# Altium project Venus.PrjPcb
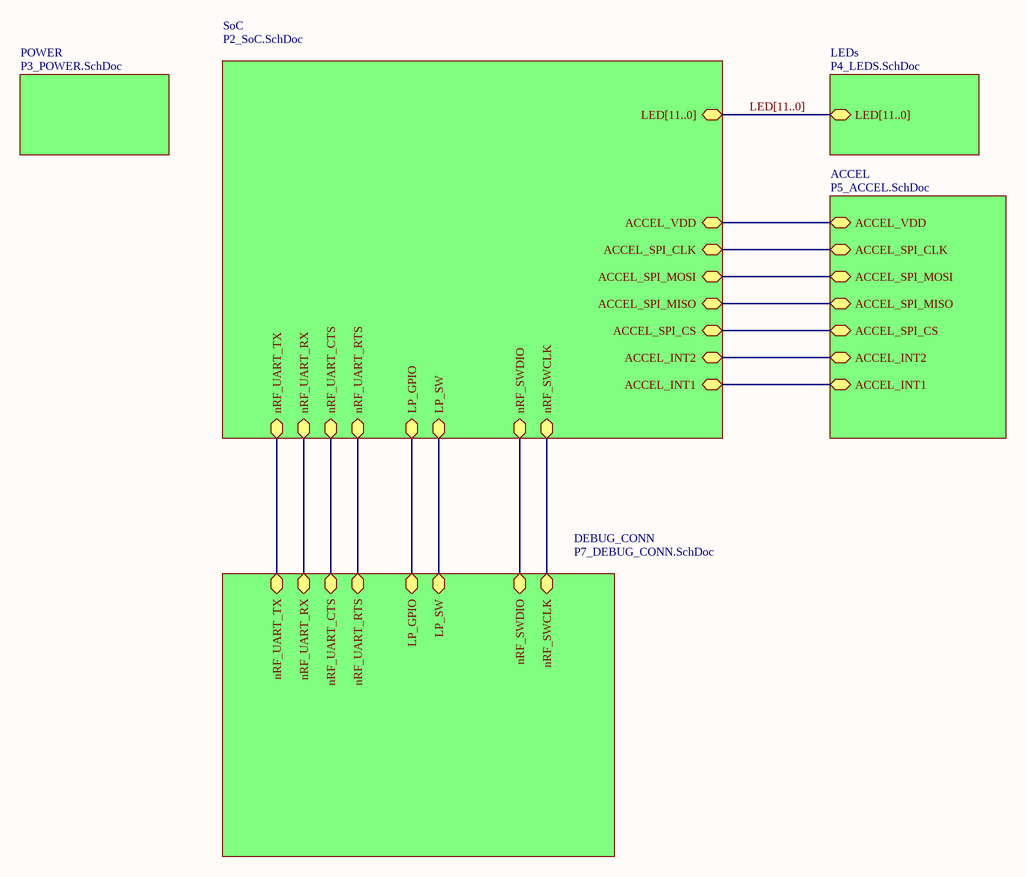
[diagram p0: P1_TOP_LEVEL.SchDoc]
Currency: USD; PCB_Description: PCB, Venus, FR4, 0.8T; PCBA_Description: PCBA, Venus; PCBAPartNumber: 06-00019-000; PCBArevision: 10; PCBPartNumber: 02-00037-000; PCBrevision: 5; ProductionQuantity: 50; Project_Title: Venus; Title: 06-00019-000 Venus
6 sheets, 73 parts. Net scope: hierarchical (ports join the sheet entries above them; power ports are global).
Board file: 02-00037-000.PcbDoc
Sheets:
  P1_TOP_LEVEL.SchDoc
    SoC = P2_SoC.SchDoc
    ACCEL = P5_ACCEL.SchDoc
    DEBUG_CONN = P7_DEBUG_CONN.SchDoc
    LEDs = P4_LEDS.SchDoc
    POWER = P3_POWER.SchDoc

## Sheet P1_TOP_LEVEL.SchDoc: 06-00019-000 Venus
size B; Organization: Misfit Wearables; Address1: 374 Woodrow St; Address2: Daly City; Address3: CA; Address4: USA

### Sub-sheets
ACCEL = P5_ACCEL.SchDoc: ACCEL_SPI_CLK, ACCEL_SPI_MOSI, ACCEL_SPI_MISO, ACCEL_SPI_CS, ACCEL_INT2, ACCEL_INT1, ACCEL_VDD
DEBUG_CONN = P7_DEBUG_CONN.SchDoc: nRF_SWDIO, nRF_SWCLK, nRF_UART_TX, nRF_UART_RX, nRF_UART_CTS, nRF_UART_RTS, LP_GPIO, LP_SW
LEDs = P4_LEDS.SchDoc: LED[11..0]
POWER = P3_POWER.SchDoc: no entries
SoC = P2_SoC.SchDoc: nRF_SWCLK, ACCEL_SPI_MOSI, ACCEL_INT1, ACCEL_INT2, nRF_SWDIO, ACCEL_SPI_MISO, ACCEL_SPI_CS, ACCEL_VDD, ACCEL_SPI_CLK, LED[11..0], nRF_UART_TX, nRF_UART_RX, nRF_UART_CTS, nRF_UART_RTS, LP_GPIO, LP_SW

### Nets
ACCEL_INT1: sheet SoC/ACCEL_INT1, sheet ACCEL/ACCEL_INT1
ACCEL_INT2: sheet SoC/ACCEL_INT2, sheet ACCEL/ACCEL_INT2
ACCEL_SPI_CLK: sheet SoC/ACCEL_SPI_CLK, sheet ACCEL/ACCEL_SPI_CLK
ACCEL_SPI_CS: sheet SoC/ACCEL_SPI_CS, sheet ACCEL/ACCEL_SPI_CS
ACCEL_SPI_MISO: sheet SoC/ACCEL_SPI_MISO, sheet ACCEL/ACCEL_SPI_MISO
ACCEL_SPI_MOSI: sheet SoC/ACCEL_SPI_MOSI, sheet ACCEL/ACCEL_SPI_MOSI
ACCEL_VDD: sheet SoC/ACCEL_VDD, sheet ACCEL/ACCEL_VDD
LP_GPIO: sheet SoC/LP_GPIO, sheet DEBUG_CONN/LP_GPIO
LP_SW: sheet SoC/LP_SW, sheet DEBUG_CONN/LP_SW
nRF_SWCLK: sheet SoC/nRF_SWCLK, sheet DEBUG_CONN/nRF_SWCLK
nRF_SWDIO: sheet SoC/nRF_SWDIO, sheet DEBUG_CONN/nRF_SWDIO
nRF_UART_CTS: sheet SoC/nRF_UART_CTS, sheet DEBUG_CONN/nRF_UART_CTS
nRF_UART_RTS: sheet SoC/nRF_UART_RTS, sheet DEBUG_CONN/nRF_UART_RTS
nRF_UART_RX: sheet SoC/nRF_UART_RX, sheet DEBUG_CONN/nRF_UART_RX
nRF_UART_TX: sheet SoC/nRF_UART_TX, sheet DEBUG_CONN/nRF_UART_TX

### Buses and harness runs
bus LED[11..0] = sheet LEDs/LED[11..0] = sheet SoC/LED[11..0]

### Notes on the sheet
- Title
- Size:
- Date:
- B
- Number:
- Time:
- Revision:
- Sheet
- of
- File:

## Sheet P2_SoC.SchDoc: 06-00019-000 Venus
size C
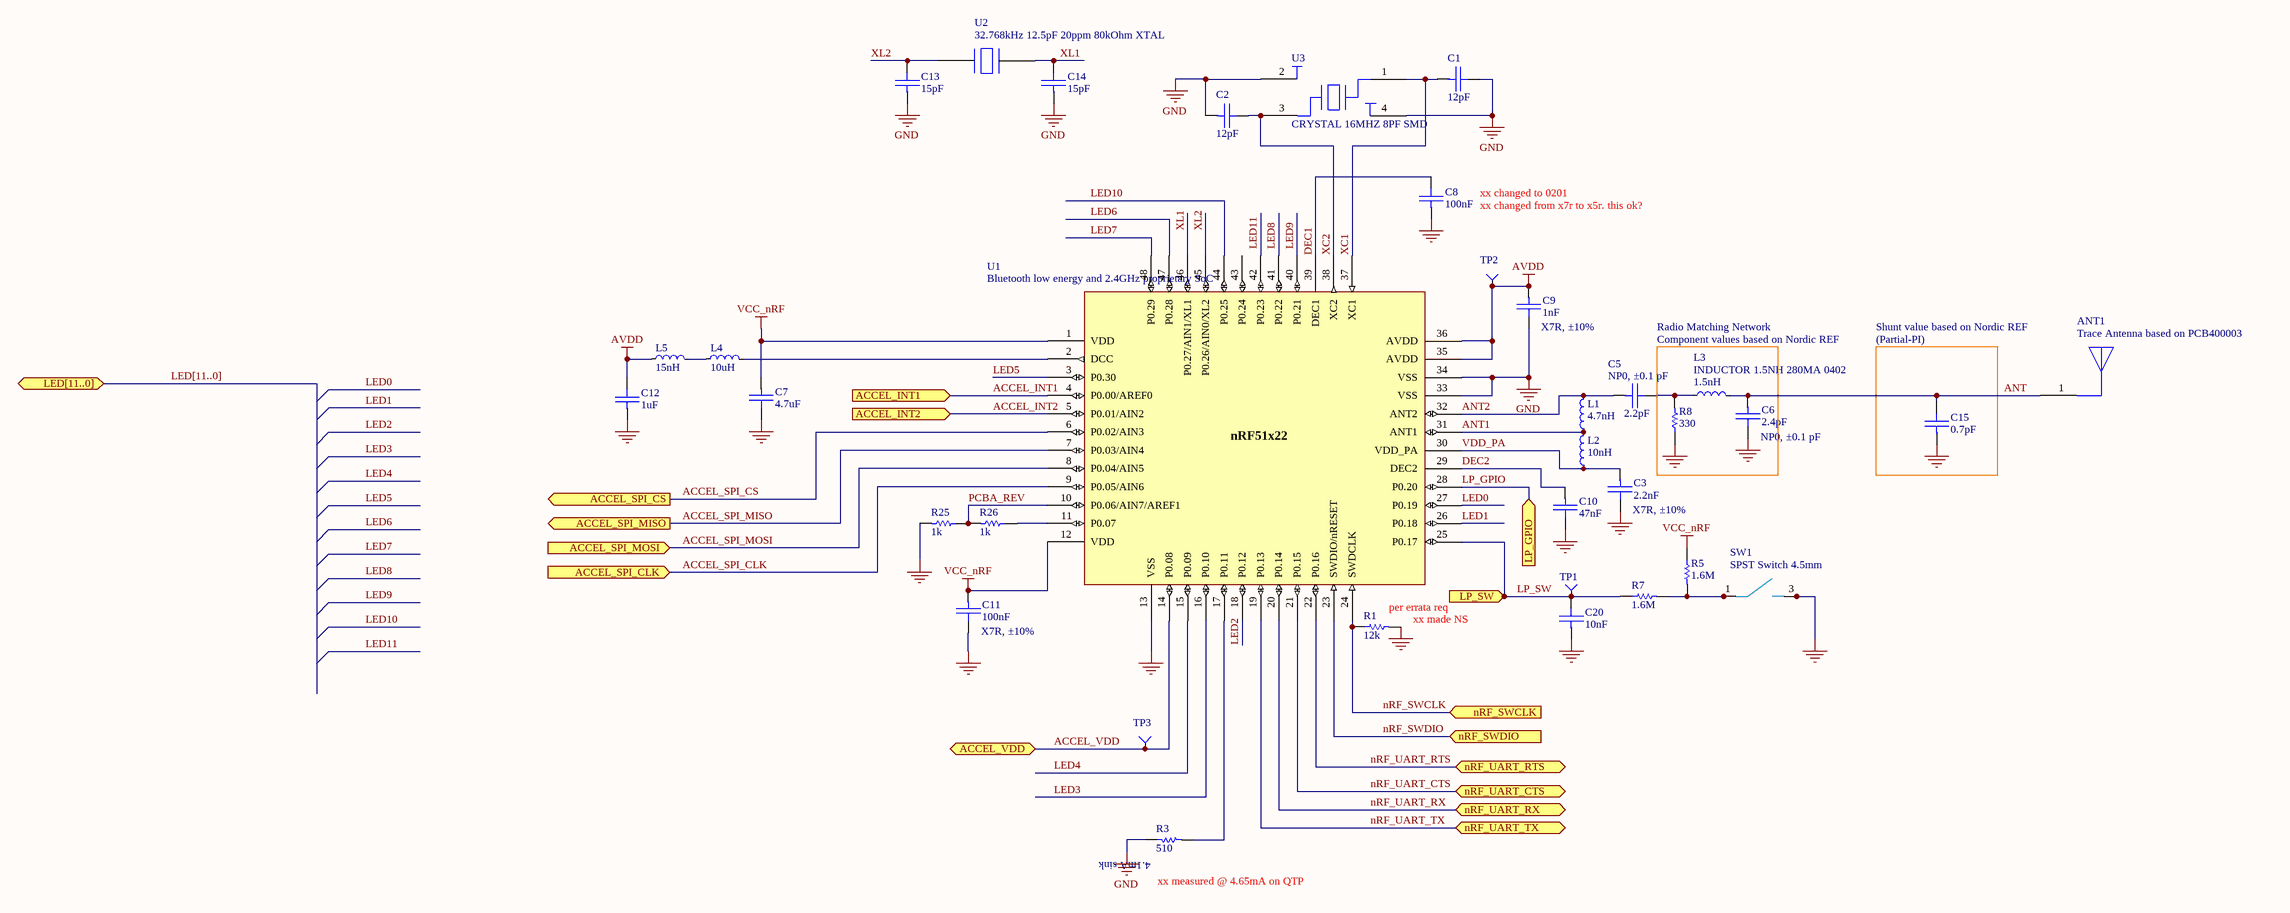
[diagram p1: P2_SoC.SchDoc]

### Parts
ANT1  Trace Antenna based on PCB400003  [NORDIC_MEAND]
C1  value 12pF  [CAPC0201(0603)_N]  (hidden comment: CAP CER 12PF 25V 5% NP0 0201)
C2  value 12pF  [CAPC0201(0603)_N]  (hidden comment: CAP CER 12PF 25V 5% NP0 0201)
C3  value 2.2nF  [CAPC0402(1005)_N]  (hidden comment: CAP CER 2200PF 50V 10% X7R 0402)
C5  value 2.2pF  [CAPC0402(1005)_N]  (hidden comment: CAP CER 2.2PF 50V NP0 0402)
C6  value 2.4pF  [CAPC0402(1005)_N]  (hidden comment: CAP CER 2.4PF 50V NP0 0402)
C7  value 4.7uF  [CAPC0603(1608)_N]  (hidden comment: CAP CER 4.7UF 6.3V 10% X5R 0603)
C8  value 100nF  [CAPC0201(0603)_N]  (hidden comment: CAP CER 0.1UF 10V 10% X5R 0201)
C9  value 1nF  [CAPC0402(1005)_N]  (hidden comment: CAP CER 1000PF 50V 10% X7R 0402)
C10  value 47nF  [CAPC0402(1005)_N]  (hidden comment: CAP CER 0.047UF 16V 10% X7R 0402)
C11  value 100nF  [CAPC0402(1005)_N]  (hidden comment: CAP CER 0.1UF 16V 10% X7R 0402)
C12  value 1uF  [CAPC0603(1608)_N]  (hidden comment: CAP CER 1UF 16V 20% X7R 0603)
C13  value 15pF  [CAPC0201(0603)_N]  (hidden comment: CAP CER 15PF 25V 5% NP0 0201)
C14  value 15pF  [CAPC0201(0603)_N]  (hidden comment: CAP CER 15PF 25V 5% NP0 0201)
C15  value 0.7pF  [CAPC0402(1005)_N]  (hidden comment: CAP CER 0.7PF 50V NP0 0402)
C20  value 10nF  [CAPC0201(0603)_N]  (hidden comment: CAP CER 10000PF 10V 10% X7R 0201)
L1  value 4.7nH  [INDC0402(1005)_N]  (hidden comment: INDUCTOR 4.7NH 160MA 0402)
L2  value 10nH  [INDC0402(1005)_N]  (hidden comment: INDUCTOR 10NH 100MA 0402)
L3  INDUCTOR 1.5NH 280MA 0402  value 1.5nH  [INDC0402(1005)_N]
L4  value 10uH  [INDC0603(1608)_N]  (hidden comment: INDUCTOR 10UH 80MA 10% 0603)
L5  value 15nH  [INDC0402(1005)_N]  (hidden comment: INDUCTOR HI FREQ 15NH 5% 0402)
R1  value 12k  [RESC0201(0603)_N]  (hidden comment: RES 12K OHM 1/20W 1% 0201 SMD)
R3  value 510  [RESC0201(0603)_N]  (hidden comment: RES 510 OHM 1/20W 5% 0201 SMD)
R5  value 1.6M  [RESC0402(1005)_N]  (hidden comment: RES 1.60M OHM 1/16W 1% 0402 SMD)
R7  value 1.6M  [RESC0402(1005)_N]  (hidden comment: RES 1.60M OHM 1/16W 1% 0402 SMD)
R8  value 330  [RESC0402(1005)_N]  (hidden comment: RES 330 OHM 1/16W 5% 0402 SMD)
R25  value 1k  [RESC0201(0603)_N]  (hidden comment: RES 1K OHM 1/20W 5% 0201 SMD)
R26  value 1k  [RESC0201(0603)_N]  (hidden comment: RES 1K OHM 1/20W 5% 0201 SMD)
SW1  SPST Switch 4.5mm  [PTS530]
TP1  12MIL SMT Test Point  [SMT_TP_12MIL]  (value not drawn)
TP2  .767mm SMT Test Point  [SMT_TP_p767mm]  (value not drawn)
TP3  .767mm SMT Test Point  [SMT_TP_p767mm]  (value not drawn)
U1  Bluetooth low energy and 2.4GHz proprietary SoC  [QFN40P600X600X90-48N]
U2  32.768kHz 12.5pF 20ppm 80kOhm XTAL  [ECX-12]
U3  CRYSTAL 16MHZ 8PF SMD  [NX2520SA]

### Ports
ACCEL_INT1, ACCEL_INT2, ACCEL_SPI_CLK, ACCEL_SPI_CS, ACCEL_SPI_MISO, ACCEL_SPI_MOSI, ACCEL_VDD, LED[11..0], LP_GPIO, LP_SW, nRF_SWCLK, nRF_SWDIO, nRF_UART_CTS, nRF_UART_RTS, nRF_UART_RX, nRF_UART_TX

### Nets
AVDD: C9.1 C12.2 L5.1 TP2.1(TP) U1.35(AVDD) U1.36(AVDD)
GND: C1.2 C2.1 C3.2 C6.2 C7.2 C8.1 C9.2 C10.2 C11.2 C12.1 C13.1 C14.1 C15.1 C20.1 R1.2 R3.1 R8.1 R25.2 SW1.3 SW1.4 U1.13(VSS) U1.33(VSS) U1.34(VSS) U1.49 U3.2(gnd) U3.4(GND)
VCC_nRF: C7.1 C11.1 R5.1 U1.1(VDD) U1.12(VDD)  [project net Vbat]
ACCEL_INT1: U1.4(P0.00/AREF0) ; port ACCEL_INT1
ACCEL_INT2: U1.5(P0.01/AIN2) ; port ACCEL_INT2
ACCEL_SPI_CLK: U1.9(P0.05/AIN6) ; port ACCEL_SPI_CLK
ACCEL_SPI_CS: U1.6(P0.02/AIN3) ; port ACCEL_SPI_CS
ACCEL_SPI_MISO: U1.7(P0.03/AIN4) ; port ACCEL_SPI_MISO
ACCEL_SPI_MOSI: U1.8(P0.04/AIN5) ; port ACCEL_SPI_MOSI
ACCEL_VDD: TP3.1(TP) U1.14(P0.08) ; port ACCEL_VDD
ANT: ANT1.1(Feed_Point) C6.1 C15.2 L3.2
ANT1: L1.1 L2.2 U1.31(ANT1)
ANT2: C5.1 L1.2 U1.32(ANT2)
DEC1: C8.2 U1.39(DEC1)
DEC2: C10.1 U1.29(DEC2)
LED0: U1.27(P0.19)
LED1: U1.26(P0.18)
LED2: U1.18(P0.12)
LED3: U1.16(P0.10)
LED4: U1.15(P0.09)
LED5: U1.3(P0.30)
LED6: U1.47(P0.28)
LED7: U1.48(P0.29)
LED8: U1.41(P0.22)
LED9: U1.40(P0.21)
LED10: U1.44(P0.25)
LED11: U1.42(P0.23)
LP_GPIO: U1.28(P0.20) ; port LP_GPIO
LP_SW: C20.2 R7.1 TP1.1(TP) U1.25(P0.17) ; port LP_SW
nRF_SWCLK: R1.1 U1.24(SWDCLK) ; port nRF_SWCLK
nRF_SWDIO: U1.23(SWDIO/nRESET) ; port nRF_SWDIO
nRF_UART_CTS: U1.21(P0.15) ; port nRF_UART_CTS
nRF_UART_RTS: U1.22(P0.16) ; port nRF_UART_RTS
nRF_UART_RX: U1.20(P0.14) ; port nRF_UART_RX
nRF_UART_TX: U1.19(P0.13) ; port nRF_UART_TX
PCBA_REV: R25.1 R26.2 U1.10(P0.06/AIN7/AREF1)
VDD_PA: C3.1 L2.1 U1.30(VDD_PA)
XC1: C1.1 U1.37(XC1) U3.1(I/O)
XC2: C2.2 U1.38(XC2) U3.3(I/O)
XL1: C14.2 U1.46(P0.27/AIN1/XL1) U2.2
XL2: C13.2 U1.45(P0.26/AIN0/XL2) U2.1
NetC5_2: C5.2 L3.1 R8.2
NetL4_1: L4.1 L5.2
NetL4_2: L4.2 U1.2(DCC)
NetR3_2: R3.2 U1.17(P0.11)
NetR5_2: R5.2 R7.2 SW1.1 SW1.2
NetR26_1: R26.1 U1.11(P0.07)

Not connected (* = marked no-connect by the designer): U1 43(P0.24)

### Buses and harness runs
bus LED[11..0] = port LED[11..0]

### Notes on the sheet
- xx changed to 0201
- xx changed from x7r to x5r. this ok?
- (near C9) X7R, ±10%
- Radio Matching Network
- Shunt value based on Nordic REF
- (near C5) NP0, ±0.1 pF
- Component values based on Nordic REF
- (Partial-PI)
- (near C6) NP0, ±0.1 pF
- (near C3) X7R, ±10%
- per errata req
- xx made NS
- (near C11) Analog Stuff Option Tracking
  R26         |     R25
  0MOhm     |     1MOhm    ==> 06-00019-000 REV9
  1k             |      1k            ==> REV10
- (near C11) X7R, ±10%
- (near R3) 4.1mA sink
- (near R3) xx measured @ 4.65mA on QTP
- Title
- Size:
- Date:
- File:
- C
- Number:
- Time:
- Revision:
- Sheet
- of
- (in symbol 03-07191-000) nRF51x22

### Library data of the parts
ANT1 = 03-07140-000: Nordic-Based Trace Antenna per PCB400003; Legacy Item Number: X01015; RoHS: Y; Item Number: 03-07140-000; Item Name: Trace Antenna based on PCB400003; Lifecycle: Preliminary; Link to Arena Files: https://app.bom.com/a/8Q9IOJ2J2LL8MEWP?v=files.associations
C1 C2 = 03-02453-000: Manufacturer 1: Samsung Electro-Mechanics America Inc; Manufacturer Item 1: CU0131120JAT2A\5K; Manufacturer Part Number 1: CL03C120JA3ANNC; Temperature Coefficient: C0G NP0; Case EIA: 201; Case Metric: 603; Tolerance: +/-5%; Legacy Item Number: C02200; RoHS: Y; Voltage Rating: 25V; Manufacturer 2: TDK Corporation; Item Number: 03-02453-000; Item Name: CAP CER 12PF 25V 5% NP0 0201; Lifecycle: Design; Manufacturer Item 2: 02013A120JAT2A; Link to Arena Files: https://app.bom.com/a/CUDMSN6N6PPCQMU0?v=files.associations; Manufacturer 3: Kemet; Manufacturer 4: Murata Electronics North America; Manufacturer Part Number 2: C0603C0G1E120J030BA; Manufacturer Part Number 3: C0201C120J3GACTU; Manufacturer Part Number 4: GRM0335C1E120JA01D; Revision: 1; Supplier 1: Avnet; Supplier 2: Avnet; Supplier 3: Digi-key; Supplier 4: Digi-key; Supplier Part Number 1: CL03C120JA3ANNC; Supplier Part Number 2: C0603C0G1E120J030BA; Supplier Part Number 3: 399-8927-1-ND; Supplier Part Number 4: 490-3144-1-ND
C3 = 03-01841-000: Manufacturer 1: NIC Components; Manufacturer Item 1: 04025C222KAT2A; Manufacturer Part Number 1: NMC0402X7R222K50TRPF; Case EIA: 402; Case Metric: 1005; Tolerance: +/-10%; Legacy Item Number: C03370; Temperature Coefficient: X7R; RoHS: Y; Voltage Rating: 50V; Manufacturer 2: Samsung Electro-Mechanics America Inc; Item Number: 03-01841-000; Item Name: CAP CER 2200PF 50V 10% X7R 0402; Lifecycle: Design; Manufacturer Item 2: C0402C222K5RACTU; Link to Arena Files: https://app.bom.com/a/SAT283M3M55S63SC?v=files.associations; Manufacturer 3: Kemet; Manufacturer 4: Murata Electronics North America; Manufacturer Part Number 2: CL05B222KB5NNNC; Manufacturer Part Number 3: C0402C222K5RACTU; Manufacturer Part Number 4: GRM155R71H222KA01D; Revision: 1; Supplier 1: Avnet; Supplier 2: Avnet; Supplier 3: Digi-key; Supplier 4: Digi-key; Supplier Part Number 1: NMC0402X7R222K50TRPF; Supplier Part Number 2: CL05B222KB5NNNC; Supplier Part Number 3: 399-3068-1-ND; Supplier Part Number 4: 490-1305-1-ND
C5 = 03-01536-000: Manufacturer 1: Murata Electronics North America; Manufacturer Item 1: 04025A2R2BAT2A; Manufacturer Part Number 1: GRM1555C1H2R2BA01D; Temperature Coefficient: C0G NP0; Case EIA: 402; Case Metric: 1005; Tolerance: +/-0.1pF; Legacy Item Number: C03065; RoHS: Y; Voltage Rating: 50V; Item Number: 03-01536-000; Item Name: CAP CER 2.2PF 50V NP0 0402; Lifecycle: Design; Link to Arena Files: https://app.bom.com/a/1J2BHCVCVEE1FCAX?v=files.associations; Manufacturer 2: Samsung Electro-Mechanics America Inc; Manufacturer Item 2: GRM1555C1H2R2BA01D; Manufacturer 3: AVX Corporation; Manufacturer Part Number 2: CL05C2R2BB5ANNC; Manufacturer Part Number 3: 04025A2R2BAT2A; Revision: 1; Supplier 1: Avnet; Supplier 2: Avnet; Supplier 3: Digi-key; Supplier Part Number 1: GRM1555C1H2R2BA01D; Supplier Part Number 2: CL05C2R2BB5ANNC; Supplier Part Number 3: 478-7876-1-ND
C6 = 03-01539-000: Manufacturer 1: Murata Electronics North America; Manufacturer Part Number 1: GRM1555C1H2R4BA01D; Temperature Coefficient: C0G NP0; Case EIA: 402; Case Metric: 1005; Tolerance: +/-0.1pF; Legacy Item Number: C03068; RoHS: Y; Voltage Rating: 50V; Item Number: 03-01539-000; Lifecycle: Preliminary; Link to Arena Files: https://app.bom.com/a/4M5EKFYFYHH4IFDM?v=files.associations; Supplier 1: Digi-key; Supplier Part Number 1: 490-6228-1-ND
C7 = 03-01442-000: Manufacturer 1: Samsung Electro-Mechanics America Inc; Manufacturer Item 1: 06036D475KAT2A; Manufacturer Part Number 1: CL10A475KQ8NNNC; Case EIA: 603; Case Metric: 1608; Tolerance: +/-10%; Legacy Item Number: C04789; Temperature Coefficient: X5R; RoHS: Y; Voltage Rating: 6.3V; Manufacturer 2: Samsung Electro-Mechanics America Inc; Item Number: 03-01442-000; Item Name: CAP CER 4.7UF 6.3V 10% X5R 0603; Lifecycle: Design; Manufacturer Item 2: C0603C475K9PACTU; Link to Arena Files: https://app.bom.com/a/DVENTO7O7QQDROOX?v=files.associations; Manufacturer 3: AVX Corporation; Manufacturer 4: Kemet; Manufacturer Part Number 2: CL10A475KQ5NNNC; Manufacturer Part Number 3: 06036D475KAT2A; Manufacturer Part Number 4: C0603C475K9PACTU; Revision: 1; Supplier 1: Avnet; Supplier 2: Avnet; Supplier 3: Digi-key; Supplier 4: Digi-key; Supplier Part Number 1: CL10A475KQ8NNNC; Supplier Part Number 2: CL10A475KQ5NNNC; Supplier Part Number 3: 478-5009-1-ND; Supplier Part Number 4: 399-3482-1-ND
C8 = 03-02751-000: Manufacturer 1: Murata Electronics North America; Manufacturer Item 1: GRM033R61A104KE15D; Case EIA: 201; Case Metric: 603; Tolerance: +/-10%; Legacy Item Number: C02498; Temperature Coefficient: X5R; RoHS: Y; Voltage Rating: 10V; Item Number: 03-02751-000; Item Name: CAP CER 0.1UF 10V 10% X5R 0201; Lifecycle: Design; Link to Arena Files: https://app.bom.com/a/UCV4A5O5O77U844W?v=files.associations; Manufacturer 2: TDK Corporation; Manufacturer Item 2: LMK063BJ104KP-F; Manufacturer Part Number 1: GRM033R61A104KE15D; Manufacturer Part Number 2: C0603X5R1A104K030BC; Revision: 1; Supplier 1: Avnet; Supplier 2: Avnet; Supplier Part Number 1: GRM033R61A104KE15D; Supplier Part Number 2: C0603X5R1A104K030BC
C9 = 03-01810-000: Manufacturer 1: NIC Components; Manufacturer Item 1: 04025C102KAT2A; Manufacturer Part Number 1: NMC0402X7R102K50TRPF; Case EIA: 402; Case Metric: 1005; Tolerance: +/-10%; Legacy Item Number: C03339; Temperature Coefficient: X7R; RoHS: Y; Voltage Rating: 50V; Item Number: 03-01810-000; Item Name: CAP CER 1000PF 50V 10% X7R 0402; Lifecycle: Design; Link to Arena Files: https://app.bom.com/a/WEX6C7Q7Q99WA7XM?v=files.associations; Manufacturer 2: Samsung Electro-Mechanics America Inc; Manufacturer Item 2: C0402T102K5RACTU; Manufacturer 3: AVX Corporation; Manufacturer 4: Kemet; Manufacturer Part Number 2: CL05B102KB5NNNC; Manufacturer Part Number 3: 04025C102KAT2A; Manufacturer Part Number 4: C0402C102K5RACTU; Revision: 1; Supplier 1: Avnet; Supplier 2: Avnet; Supplier 3: Digi-key; Supplier 4: Digi-key; Supplier Part Number 1: NMC0402X7R102K50TRPF; Supplier Part Number 2: CL05B102KB5NNNC; Supplier Part Number 3: 478-1101-1-ND; Supplier Part Number 4: 399-1032-1-ND
C10 = 03-02012-000: Manufacturer 1: Kemet; Manufacturer Item 1: 0402YC473KAT2A; Manufacturer Part Number 1: C0402C473K4RAC TU; Case EIA: 402; Case Metric: 1005; Tolerance: +/-10%; Legacy Item Number: C03541; Temperature Coefficient: X7R; RoHS: Y; Voltage Rating: 16V; Manufacturer 2: Samsung Electro-Mechanics America Inc; Item Number: 03-02012-000; Item Name: CAP CER 0.047UF 16V 10% X7R 0402; Lifecycle: Design; Manufacturer Item 2: C0402C473K4RACTU; Link to Arena Files: https://app.bom.com/a/P7QZ50J0J22P30KA?v=files.associations; Manufacturer 3: Murata Electronics North America; Manufacturer 4: Murata Electronics North America; Manufacturer Part Number 2: CL05B473KO5NNNC; Manufacturer Part Number 3: GRM155R71C473KA01D; Manufacturer Part Number 4: GCM155R71C473KA37D; Revision: 1; Supplier 1: Avnet; Supplier 2: Avnet; Supplier 3: Digi-key; Supplier 4: Digi-key; Supplier Part Number 1: C0402C473K4RAC TU; Supplier Part Number 2: CL05B473KO5NNNC; Supplier Part Number 3: 490-6335-1-ND; Supplier Part Number 4: 490-6042-1-ND
C11 = 03-02077-000: Manufacturer 1: Kemet; Manufacturer Item 1: C0402C104K4RACTU; Manufacturer Part Number 1: C0402C104K4RAC TU; Case EIA: 402; Case Metric: 1005; Tolerance: +/-10%; Legacy Item Number: C03606; Temperature Coefficient: X7R; RoHS: Y; Voltage Rating: 16V; Manufacturer 2: Samsung Electro-Mechanics America Inc; Item Number: 03-02077-000; Item Name: CAP CER 0.1UF 16V 10% X7R 0402; Lifecycle: Design; Manufacturer Item 2: C0402C104K4RACAUTO; Link to Arena Files: https://app.bom.com/a/L3MV1WFWFYYLZVEO?v=files.associations; Manufacturer 3: Kemet; Manufacturer 4: Kemet; Manufacturer Part Number 2: CL05B104KO5NNNC; Manufacturer Part Number 3: C0402C104K4RACTU; Manufacturer Part Number 4: C0402C104K4RACAUTO; Revision: 1; Supplier 1: Avnet; Supplier 2: Avnet; Supplier 3: Digi-key; Supplier 4: Digi-key; Supplier Part Number 1: C0402C104K4RAC TU; Supplier Part Number 2: CL05B104KO5NNNC; Supplier Part Number 3: 399-3521-1-ND; Supplier Part Number 4: 399-6828-1-ND
C12 = 03-01346-000: Manufacturer 1: Samsung Electro-Mechanics America Inc; Manufacturer Item 1: GRM188R71C105MA12D; Manufacturer Part Number 1: CL10B105KO8NNND; Case EIA: 603; Case Metric: 1608; Tolerance: +/-20%; Legacy Item Number: C04693; Temperature Coefficient: X7R; RoHS: Y; Voltage Rating: 16V; Manufacturer 2: TAIYO YUDEN; Item Number: 03-01346-000; Item Name: CAP CER 1UF 16V 20% X7R 0603; Lifecycle: Design; Manufacturer Item 2: C1608X7R1C105M080AC; Link to Arena Files: https://app.bom.com/a/M4NW2XGXGZZM0X0Z?v=files.associations; Manufacturer 3: Murata Electronics North America; Manufacturer 4: TDK Corporation; Manufacturer Part Number 2: EMK107B7105KAHT; Manufacturer Part Number 3: GRM188R71C105MA12D; Manufacturer Part Number 4: CGA3E1X7R1C105M080AC; Revision: 1; Supplier 1: Avnet; Supplier 2: Avnet; Supplier 3: Digi-key; Supplier 4: Digi-key; Supplier Part Number 1: CL10B105KO8NNND; Supplier Part Number 2: EMK107B7105KAHT; Supplier Part Number 3: 490-6424-1-ND; Supplier Part Number 4: 445-12540-1-ND
C13 C14 = 03-02464-000: Manufacturer 1: Samsung Electro-Mechanics America Inc; Manufacturer Part Number 1: CL03C150JA3ANNC; Legacy Item Number: C02211; Case EIA: 201; Case Metric: 603; Temperature Coefficient: C0G NP0; Tolerance: +/-5%; Item Number: 03-02464-000; RoHS: Y; Lifecycle: Design; Link to Arena Files: https://app.bom.com/a/N5OX3YHYH00N1X5P?v=files.associations; Revision: 1; Supplier 1: Digi-key; Supplier Part Number 1: 1276-1390-1-ND; Manufacturer 2: TDK Corporation; Manufacturer Part Number 2: C0603C0G1E150J030BA; Supplier 2: Digi-key; Supplier Part Number 2: 445-4655-1-ND; Voltage Rating: 25V
C15 = 03-01494-000: Manufacturer 1: Murata Electronics North America; Manufacturer Part Number 1: GJM1555C1HR70BB01D; Legacy Item Number: C03023; Case EIA: 402; Case Metric: 1005; Temperature Coefficient: C0G NP0; Tolerance: +/-0.1pF; Item Number: 03-01494-000; RoHS: Y; Lifecycle: Preliminary; Link to Arena Files: https://app.bom.com/a/UCV4A5O5O77U854V?v=files.associations; Supplier 1: Digi-key; Supplier Part Number 1: 490-6079-1-ND; Manufacturer 2: Murata Electronics North America; Manufacturer Part Number 2: GRM1535C1HR70BDD5D; Supplier 2: Digi-key; Supplier Part Number 2: 490-6165-1-ND; Manufacturer 3: Murata Electronics North America; Manufacturer Part Number 3: GRM1555C1HR70BA01D; Supplier 3: Digi-key; Supplier Part Number 3: 490-6267-1-ND; Voltage Rating: 50V
C20 = 03-02706-000: Manufacturer 1: Murata Electronics North America; Manufacturer Item 1: GRM033R71A103KA01J; Manufacturer Part Number 1: GRM033R71A103KA01D; Case EIA: 201; Case Metric: 603; Tolerance: +/-10%; Legacy Item Number: C02453; Temperature Coefficient: X7R; RoHS: Y; Voltage Rating: 10V; Item Number: 03-02706-000; Item Name: CAP CER 10000PF 10V 10% X7R 0201; Lifecycle: Design; Link to Arena Files: https://app.bom.com/a/K2LU0VEVEXXKYUVT?v=files.associations; Manufacturer 2: Samsung Electro-Mechanics America Inc; Manufacturer Item 2: GRM033R71A103KA01D; Manufacturer 3: Murata Electronics North America; Manufacturer 4: Murata Electronics North America; Manufacturer Part Number 2: CL03B103KP3NNNC; Manufacturer Part Number 3: GCM033R71A103KA03D; Manufacturer Part Number 4: GRM033R71A103KA01J; Revision: 1; Supplier 1: Avnet; Supplier 2: Avnet; Supplier 3: Digi-key; Supplier 4: Digi-key; Supplier Part Number 1: GRM033R71A103KA01D; Supplier Part Number 2: CL03B103KP3NNNC; Supplier Part Number 3: 490-6040-1-ND; Supplier Part Number 4: 490-6143-1-ND
L1 = 03-07166-000: Manufacturer 1: Murata; Manufacturer Item 1: LQP15MN4N7B02D; Legacy Item Number: L01007; Package / Case: 0402(1005); RoHS: Y; Item Number: 03-07166-000; Item Name: INDUCTOR 4.7NH 160MA 0402; Lifecycle: Design; Link to Arena Files: https://app.bom.com/a/9RAJPK3K3MM9NDKS?v=files.associations; Manufacturer Part Number 1: LQP15MN4N7B02D; Revision: 1; Supplier 1: Avnet; Supplier Part Number 1: LQP15MN4N7B02D
L2 = 03-07167-000: Manufacturer 1: Murata; Manufacturer Item 1: 81-LQP15MN10NG02D; Legacy Item Number: L01008; Package / Case: 0402(1005); RoHS: Y; Item Number: 03-07167-000; Item Name: INDUCTOR 10NH 100MA 0402; Lifecycle: Design; Link to Arena Files: https://app.bom.com/a/ASBKQL4L4NNAOELD?v=files.associations; Manufacturer Part Number 1: 81-LQP15MN10NG02D; Revision: 1; Supplier 1: Avnet; Supplier Part Number 1: LQP15MN10NG02D
L3 = 03-07203-000: Manufacturer 1: Murata Electronics North America; Manufacturer Part Number 1: LQP15MN1N5B02D; Package / Case: 0402(1005); RoHS: Y; Item Number: 03-07203-000; Lifecycle: Design; Link to Arena Files: https://app.bom.com/a/8Q9IOJ2J2LL7MRTG?v=files.associations; Revision: 1; Supplier 1: Digi-key; Supplier Part Number 1: 490-1126-1-ND
L4 = 03-07169-000: Manufacturer 1: TAIYO YUDEN; Manufacturer Item 1: LBMF1608T100K; Legacy Item Number: L01010; Package / Case: 0603 (1608); RoHS: Y; Item Number: 03-07169-000; Item Name: INDUCTOR 10UH 80MA 10% 0603; Lifecycle: Design; Link to Arena Files: https://app.bom.com/a/CUDMSN6N6PPCQGND?v=files.associations; Manufacturer Part Number 1: LBMF1608T100K; Revision: 1; Supplier 1: Avnet; Supplier Part Number 1: LBMF1608T100K
L5 = 03-07170-000: Manufacturer 1: Samsung Electro-Mechanics America Inc; Manufacturer Item 1: HK100515NJ-T; Manufacturer Part Number 1: CIH05T15NJNC; Legacy Item Number: L01011; Package / Case: 0402(1005); RoHS: Y; Item Number: 03-07170-000; Item Name: INDUCTOR HI FREQ 15NH 5% 0402; Lifecycle: Design; Link to Arena Files: https://app.bom.com/a/DVENTO7O7QQDRHOC?v=files.associations; Manufacturer 2: TAIYO YUDEN; Manufacturer Part Number 2: HK100515NJ-T; Revision: 1; Supplier 1: Avnet; Supplier 2: Avnet; Supplier Part Number 1: CIH05T15NJNC; Supplier Part Number 2: HK100515NJ-T
R1 = 03-03710-000: Manufacturer 1: Panasonic Electronic Components; Manufacturer Item 1: ERJ-1GEF1202C; Temperature Coefficient: 0.05W 1/20W; Case EIA: 201; Case Metric: 603; Tolerance: +/-1%; Legacy Item Number: R02520; RoHS: Y; Manufacturer 2: Vishay Dale; Item Number: 03-03710-000; Item Name: RES 12K OHM 1/20W 1% 0201 SMD; Lifecycle: Preliminary; Manufacturer Item 2: CRCW020112K0FKED; Link to Arena Files: https://app.bom.com/a/TBU394N4N66T728F?v=files.associations; Manufacturer 3: Yageo; Manufacturer Part Number 1: ERJ-1GEF1202C; Manufacturer Part Number 2: CRCW020112K0FKED; Manufacturer Part Number 3: RC0201FR-0712KL; Power Rating: 0.05W 1/20W; Supplier 1: Digi-key; Supplier 2: Digi-key; Supplier 3: Digi-key; Supplier Part Number 1: P12.0KABCT-ND; Supplier Part Number 2: 541-12.0KAABCT-ND; Supplier Part Number 3: 311-12.0KMCT-ND
R3 = 03-03256-000: Manufacturer 1: Panasonic Electronic Components; Manufacturer Item 1: ERJ-1GEJ511C; Temperature Coefficient: 0.05W 1/20W; Case EIA: 201; Case Metric: 603; Tolerance: +/-5%; Legacy Item Number: R02066; RoHS: Y; Item Number: 03-03256-000; Item Name: RES 510 OHM 1/20W 5% 0201 SMD; Lifecycle: Design; Link to Arena Files: https://app.bom.com/a/Q8R061K1K33Q4ZH2?v=files.associations; Manufacturer Part Number 1: ERJ-1GEJ511C; Power Rating: 0.05W 1/20W; Revision: 1; Supplier 1: Digi-key; Supplier Part Number 1: P510AGCT-ND
R5 R7 = 03-04846-000: Manufacturer 1: Vishay Dale; Manufacturer Item 1: CRCW04021M60FKED; Temperature Coefficient: 0.063W 1/16W; Case EIA: 402; Case Metric: 1005; Tolerance: +/-1%; Legacy Item Number: R03915; RoHS: Y; Item Number: 03-04846-000; Item Name: RES 1.60M OHM 1/16W 1% 0402 SMD; Lifecycle: Design; Link to Arena Files: https://app.bom.com/a/CUDMSN6N6PPCQKUF?v=files.associations; Manufacturer Part Number 1: CRCW04021M60FKED; Power Rating: 0.063W 1/16W; Revision: 1; Supplier 1: Digi-key; Supplier Part Number 1: 541-1.60MLCT-ND
R8 = 03-04000-000: Manufacturer 1: Panasonic Electronic Components; Manufacturer Part Number 1: ERJ-2GEJ331X; Legacy Item Number: R03069; Case EIA: 402; Case Metric: 1005; Power Rating: 0.063W 1/16W; Tolerance: +/-5%; Item Number: 03-04000-000; RoHS: Y; Lifecycle: Preliminary; Link to Arena Files: https://app.bom.com/a/3L4DJEXEXGG3HCA8?v=files.associations; Supplier 1: Digi-key; Supplier Part Number 1: P330JCT-ND; Manufacturer 2: Vishay Dale; Manufacturer Part Number 2: CRCW0402330RJNED; Supplier 2: Digi-key; Supplier Part Number 2: 541-330JCT-ND; Manufacturer 3: Yageo; Manufacturer Part Number 3: RC0402JR-07330RL; Supplier 3: Digi-key; Supplier Part Number 3: 311-330JRCT-ND
R25 R26 = 03-03263-000: Manufacturer 1: Panasonic Electronic Components; Manufacturer Part Number 1: ERJ-1GEJ102C; Case EIA: 201; Case Metric: 603; Tolerance: +/-5%; Legacy Item Number: R02073; Power Rating: 0.05W 1/20W; RoHS: Y; Manufacturer 2: Vishay Dale; Item Number: 03-03263-000; Lifecycle: Preliminary; Link to Arena Files: https://app.bom.com/a/YGZ8E9S9SBBYC7PH?v=files.associations; Manufacturer 3: Yageo; Manufacturer Part Number 2: CRCW02011K00JNED; Manufacturer Part Number 3: RC0201JR-071KL; Supplier 1: Digi-key; Supplier 2: Digi-key; Supplier 3: Digi-key; Supplier Part Number 1: P1.0KAGCT-ND; Supplier Part Number 2: 541-1.0KAGCT-ND; Supplier Part Number 3: 311-1KNCT-ND
SW1 = 03-07195-000: Manufacturer 1: C&K Components; Manufacturer Part Number 1: PTS530 GK055 SMTR LFS; Legacy Item Number: S01001; Item Number: 03-07195-000; Item Name: SPST Switch 4.5mm; Lifecycle: Design; Revision: 1; Link to Arena Files: https://app.bom.com/a/ASBKQL4L4NNABANC?v=files.associations; RoHS: Y
TP1 = 03-07143-000: Test Point; Legacy Item Number: X01018; RoHS: Y; Item Number: 03-07143-000; Item Name: 12MIL SMT Test Point; Lifecycle: Preliminary; Link to Arena Files: https://app.bom.com/a/BTCLRM5M5OOBPHZ8?v=files.associations
TP2 TP3 = 03-07130-000: Test Point; Legacy Item Number: X01005; RoHS: Y; Item Number: 03-07130-000; Item Name: .767mm SMT Test Point; Lifecycle: Preliminary; Link to Arena Files: https://app.bom.com/a/YGZ8E9S9SBBYC4MB?v=files.associations
U1 = 03-07191-000: Part Number: nRF51x22-Q48-6x6_DCDC; Manufacturer: Nordic Semiconductor; Manufacturer 1: Nordic; Manufacturer Item 1: nRF51822; Manufacturer Part Number 1: NRF51822-QFAA; Note: nRF51x22 - QFN48 6x6 0.4mm pitch; Artikkelnr Noca: N.A.; Legacy Item Number: U01013; Manufacturer Part Number: *; Datasheet: *; Footprint: QFN-48; LatestRevisionDate: 2012-05-29; Pin Count: 48; Publisher: Nordic Semiconductor; Published: 2010-12-21; Supplier: Nordic Semiconductor; Supplier part number: *; 2nd source Supplier: *; 2nd source part number: *; Package / Case: nRF51822-QFx; RoHS: Y; Item Number: 03-07191-000; Item Name: Bluetooth low energy and 2.4GHz proprietary SoC; Lifecycle: Design; Link to Arena Files: https://app.bom.com/a/6O7GMH0H0JJ6J8PA?v=files.associations; Revision: 1; Supplier 1: Digi-key; Supplier Part Number 1: 1490-1031-2-ND
U2 = 03-07202-000: Generic 2-port oscillator; Package / Case: ECX-12; RoHS: Y; Item Number: 03-07202-000; Lifecycle: Preliminary; Link to Arena Files: https://app.bom.com/a/N5OX3YHYH00M38KM?v=files.associations
U3 = 03-07138-000: Generic 4-port oscillator; Manufacturer 1: NDK; Manufacturer Item 1: NX2520SA-16MHZ-STD-CSW-4; Legacy Item Number: X01013; Vendor 1: Digi-key; Vendor Item 1: 644-1168-1-ND; RoHS: Y; Item Number: 03-07138-000; Item Name: CRYSTAL 16MHZ 8PF SMD; Lifecycle: Design; Link to Arena Files: https://app.bom.com/a/6O7GMH0H0JJ6KCUE?v=files.associations; Revision: 2; Manufacturer 2: Epson; Manufacturer Part Number 1: NX2520SA-16MHZ-STD-CSW-4; Manufacturer Part Number 2: FA-20H 16.0000MF 20X-AJ; Supplier 1: Digi-key; Supplier 2: Epson; Supplier Part Number 1: 644-1168-1-ND; Supplier Part Number 2: FA-20H 16.0000MF 20X-AJ

## Sheet P5_ACCEL.SchDoc: 06-00019-000 Venus
size A
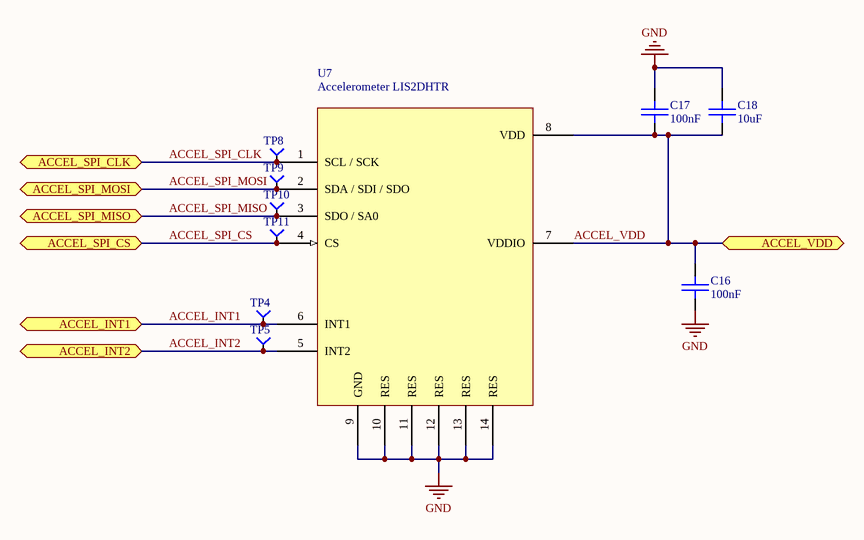
[diagram p2: P5_ACCEL.SchDoc]

### Parts
C16  value 100nF  [CAPC0201(0603)_N]  (hidden comment: CAP CER 0.1UF 10V 10% X5R 0201)
C17  value 100nF  [CAPC0201(0603)_N]  (hidden comment: CAP CER 0.1UF 10V 10% X5R 0201)
C18  value 10uF  [CAPC0603(1608)_N]  (hidden comment: CAP CER 10UF 6.3V 20% X5R 0603)
TP4  TEST POINT 5MILx20MIL  [SMT_TP_5milx20mil]  (value not drawn)
TP5  TEST POINT 5MILx20MIL  [SMT_TP_5milx20mil]  (value not drawn)
TP8  TEST POINT 5MILx20MIL  [SMT_TP_5milx20mil]  (value not drawn)
TP9  TEST POINT 5MILx20MIL  [SMT_TP_5milx20mil]  (value not drawn)
TP10  TEST POINT 5MILx20MIL  [SMT_TP_5milx20mil]  (value not drawn)
TP11  TEST POINT 5MILx20MIL  [SMT_TP_5milx20mil]  (value not drawn)
U7  Accelerometer LIS2DHTR  [LGA14N]

### Ports
ACCEL_INT1, ACCEL_INT2, ACCEL_SPI_CLK, ACCEL_SPI_CS, ACCEL_SPI_MISO, ACCEL_SPI_MOSI, ACCEL_VDD

### Nets
GND: C16.1 C17.2 C18.2 U7.9(GND) U7.10(RES) U7.11(RES) U7.12(RES) U7.13(RES) U7.14(RES)
ACCEL_INT1: TP4.1(TP) U7.6(INT1) ; port ACCEL_INT1
ACCEL_INT2: TP5.1(TP) U7.5(INT2) ; port ACCEL_INT2
ACCEL_SPI_CLK: TP8.1(TP) U7.1(SCL_/_SCK) ; port ACCEL_SPI_CLK
ACCEL_SPI_CS: TP11.1(TP) U7.4(CS) ; port ACCEL_SPI_CS
ACCEL_SPI_MISO: TP10.1(TP) U7.3(SDO_/_SA0) ; port ACCEL_SPI_MISO
ACCEL_SPI_MOSI: TP9.1(TP) U7.2(SDA_/_SDI_/_SDO) ; port ACCEL_SPI_MOSI
ACCEL_VDD: C16.2 C17.1 C18.1 U7.7(VDDIO) U7.8(VDD) ; port ACCEL_VDD

### Library data of the parts
C16 C17 = 03-02751-000: as C8 on sheet P2_SoC; Temperature Coefficient: X5R; RoHS: Y; Voltage Rating: 10V; Manufacturer 2: TDK Corporation; Item Number: 03-02751-000; Item Name: CAP CER 0.1UF 10V 10% X5R 0201; Lifecycle: Design; Manufacturer Item 2: LMK063BJ104KP-F; Link to Arena Files: https://app.bom.com/a/UCV4A5O5O77U844W?v=files.associations; Manufacturer Part Number 1: GRM033R61A104KE15D; Manufacturer Part Number 2: C0603X5R1A104K030BC; Revision: 1; Supplier 1: Avnet; Supplier 2: Avnet; Supplier Part Number 1: GRM033R61A104KE15D; Supplier Part Number 2: C0603X5R1A104K030BC
C18 = 03-01465-000: Manufacturer 1: NIC Components; Manufacturer Item 1: QM036D106MAT2A; Manufacturer Part Number 1: NMC0603X5R106M6.3TRP4KF; Case EIA: 603; Case Metric: 1608; Tolerance: +/-20%; Legacy Item Number: C04812; Temperature Coefficient: X5R; RoHS: Y; Voltage Rating: 6.3V; Item Number: 03-01465-000; Item Name: CAP CER 10UF 6.3V 20% X5R 0603; Lifecycle: Design; Link to Arena Files: https://app.bom.com/a/0I1AGBUBUDD0EBBR?v=files.associations; Manufacturer 2: Samsung Electro-Mechanics America Inc; Manufacturer Item 2: 06036D106MAT2A; Manufacturer 3: AVX Corporation; Manufacturer 4: Kemet; Manufacturer Part Number 2: CL10A106MQ8NNNC; Manufacturer Part Number 3: 06036D106MAT2A; Manufacturer Part Number 4: C0603C106M9PACTU; Revision: 1; Supplier 1: Avnet; Supplier 2: Avnet; Supplier 3: Digi-key; Supplier 4: Digi-key; Supplier Part Number 1: NMC0603X5R106M6.3TRP4KF; Supplier Part Number 2: CL10A106MQ8NNNC; Supplier Part Number 3: 478-5318-1-ND; Supplier Part Number 4: 399-5504-1-ND
TP4 TP5 TP8-TP11 = 03-07196-000: Test Point; Legacy Item Number: X01020; Item Name: TP SMT 5 x 20mil; RoHS: Y; Item Number: 03-07196-000; Lifecycle: Preliminary; Link to Arena Files: https://app.bom.com/a/3L4DJEXEXGG343DZ?v=files.associations
U7 = 03-07192-000: STMicro 3-axis accelerometer; Legacy Item Number: U01014; Package / Case: LGA14; RoHS: Y; Manufacturer 1: STMicro; Item Number: 03-07192-000; Item Name: Accelerometer LIS2DHTR; Lifecycle: Design; Manufacturer Item 1: LIS2DHTR; Link to Arena Files: https://app.bom.com/a/7P8HNI1I1KK7K9QH?v=files.associations; Manufacturer Part Number 1: LIS2DHTR; Revision: 1; Supplier 1: Digi-key; Supplier Part Number 1: 497-13795-2-ND

## Sheet P7_DEBUG_CONN.SchDoc: 06-00019-000 Venus
size A
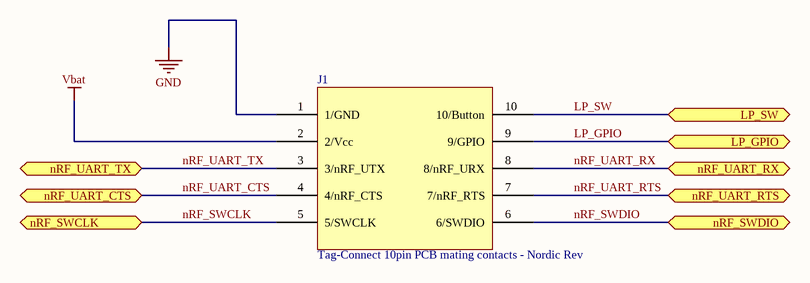
[diagram p3: P7_DEBUG_CONN.SchDoc]

### Parts
J1  Tag-Connect 10pin PCB mating contacts - Nordic Rev  [TAG_CONNECT_10P]

### Ports
LP_GPIO, LP_SW, nRF_SWCLK, nRF_SWDIO, nRF_UART_CTS, nRF_UART_RTS, nRF_UART_RX, nRF_UART_TX

### Nets
GND: J1.1(1/GND)
Vbat: J1.2(2/Vcc)
LP_GPIO: J1.9(9/GPIO) ; port LP_GPIO
LP_SW: J1.10(10/Button) ; port LP_SW
nRF_SWCLK: J1.5(5/SWCLK) ; port nRF_SWCLK
nRF_SWDIO: J1.6(6/SWDIO) ; port nRF_SWDIO
nRF_UART_CTS: J1.4(4/nRF_CTS) ; port nRF_UART_CTS
nRF_UART_RTS: J1.7(7/nRF_RTS) ; port nRF_UART_RTS
nRF_UART_RX: J1.8(8/nRF_URX) ; port nRF_UART_RX
nRF_UART_TX: J1.3(3/nRF_UTX) ; port nRF_UART_TX

### Library data of the parts
J1 = 03-07153-000: Tag-Connect plug of nails  PCB mating contacts - Nordic REV; Legacy Item Number: J01008; Item Number: 03-07153-000; RoHS: Y; Lifecycle: Preliminary; Link to Arena Files: https://app.bom.com/a/CUDMSN6N6PPCQIZT?v=files.associations

## Sheet P4_LEDS.SchDoc: 06-00019-000 Venus
size A
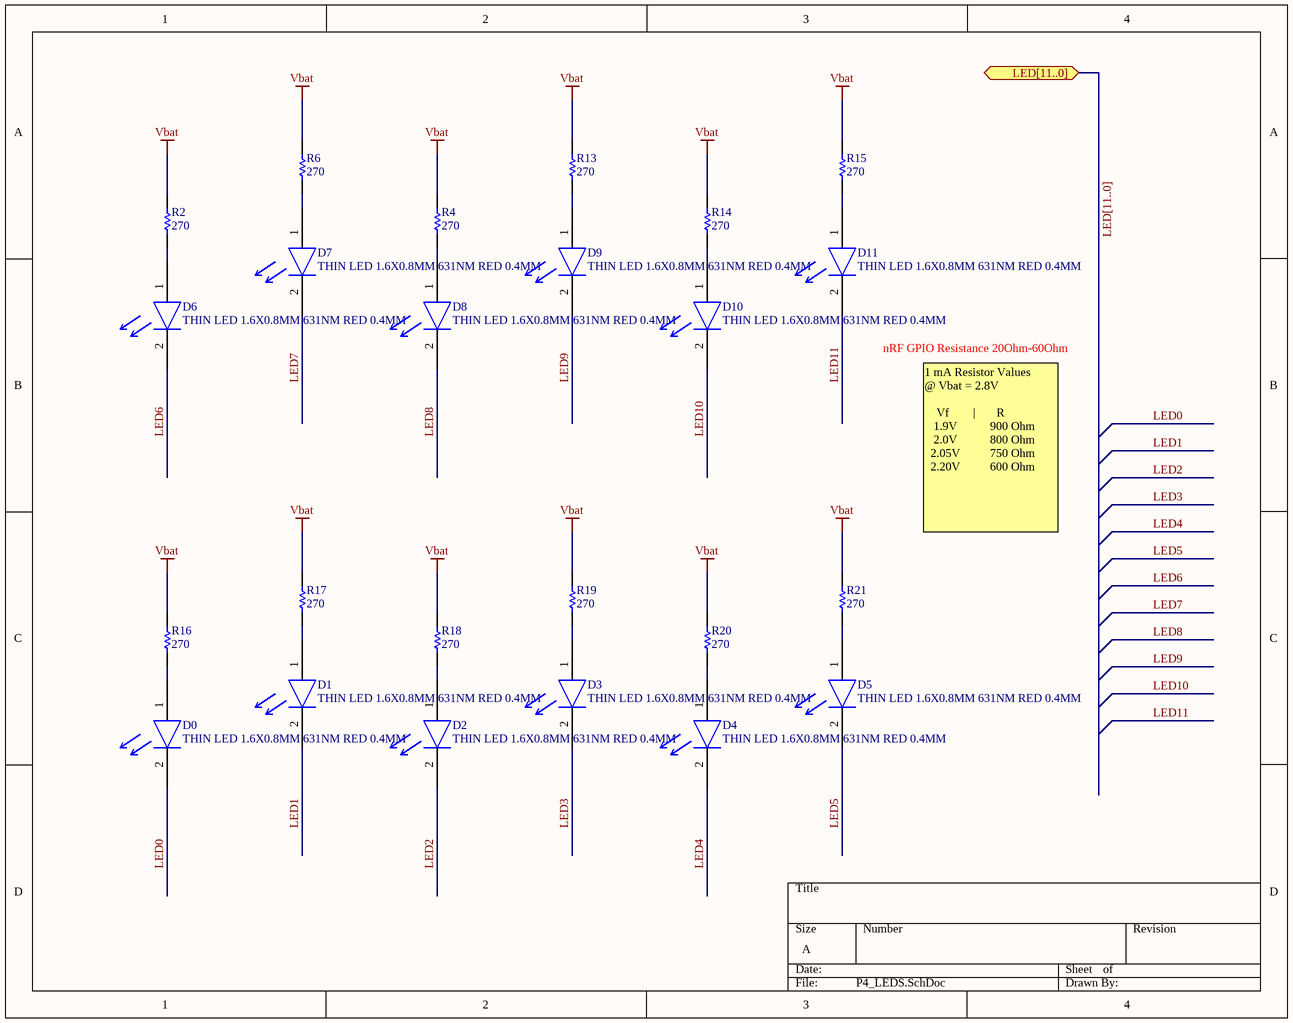
[diagram p4: P4_LEDS.SchDoc]

### Parts
D0  THIN LED 1.6X0.8MM 631NM RED 0.4MM  [LEDC0603(1608)_N]
D1  THIN LED 1.6X0.8MM 631NM RED 0.4MM  [LEDC0603(1608)_N]
D2  THIN LED 1.6X0.8MM 631NM RED 0.4MM  [LEDC0603(1608)_N]
D3  THIN LED 1.6X0.8MM 631NM RED 0.4MM  [LEDC0603(1608)_N]
D4  THIN LED 1.6X0.8MM 631NM RED 0.4MM  [LEDC0603(1608)_N]
D5  THIN LED 1.6X0.8MM 631NM RED 0.4MM  [LEDC0603(1608)_N]
D6  THIN LED 1.6X0.8MM 631NM RED 0.4MM  [LEDC0603(1608)_N]
D7  THIN LED 1.6X0.8MM 631NM RED 0.4MM  [LEDC0603(1608)_N]
D8  THIN LED 1.6X0.8MM 631NM RED 0.4MM  [LEDC0603(1608)_N]
D9  THIN LED 1.6X0.8MM 631NM RED 0.4MM  [LEDC0603(1608)_N]
D10  THIN LED 1.6X0.8MM 631NM RED 0.4MM  [LEDC0603(1608)_N]
D11  THIN LED 1.6X0.8MM 631NM RED 0.4MM  [LEDC0603(1608)_N]
R2  value 270  [RESC0201(0603)_N]  (hidden comment: RES 270 OHM 1/20W 5% 0201 SMD)
R4  value 270  [RESC0201(0603)_N]  (hidden comment: RES 270 OHM 1/20W 5% 0201 SMD)
R6  value 270  [RESC0201(0603)_N]  (hidden comment: RES 270 OHM 1/20W 5% 0201 SMD)
R13  value 270  [RESC0201(0603)_N]  (hidden comment: RES 270 OHM 1/20W 5% 0201 SMD)
R14  value 270  [RESC0201(0603)_N]  (hidden comment: RES 270 OHM 1/20W 5% 0201 SMD)
R15  value 270  [RESC0201(0603)_N]  (hidden comment: RES 270 OHM 1/20W 5% 0201 SMD)
R16  value 270  [RESC0201(0603)_N]  (hidden comment: RES 270 OHM 1/20W 5% 0201 SMD)
R17  value 270  [RESC0201(0603)_N]  (hidden comment: RES 270 OHM 1/20W 5% 0201 SMD)
R18  value 270  [RESC0201(0603)_N]  (hidden comment: RES 270 OHM 1/20W 5% 0201 SMD)
R19  value 270  [RESC0201(0603)_N]  (hidden comment: RES 270 OHM 1/20W 5% 0201 SMD)
R20  value 270  [RESC0201(0603)_N]  (hidden comment: RES 270 OHM 1/20W 5% 0201 SMD)
R21  value 270  [RESC0201(0603)_N]  (hidden comment: RES 270 OHM 1/20W 5% 0201 SMD)

### Ports
LED[11..0]

### Nets
Vbat: R2.1 R4.1 R6.1 R13.1 R14.1 R15.1 R16.1 R17.1 R18.1 R19.1 R20.1 R21.1
LED0: D0.2(Cathode)
LED1: D1.2(Cathode)
LED2: D2.2(Cathode)
LED3: D3.2(Cathode)
LED4: D4.2(Cathode)
LED5: D5.2(Cathode)
LED6: D6.2(Cathode)
LED7: D7.2(Cathode)
LED8: D8.2(Cathode)
LED9: D9.2(Cathode)
LED10: D10.2(Cathode)
LED11: D11.2(Cathode)
NetD0_1: D0.1(anode) R16.2
NetD1_1: D1.1(anode) R17.2
NetD2_1: D2.1(anode) R18.2
NetD3_1: D3.1(anode) R19.2
NetD4_1: D4.1(anode) R20.2
NetD5_1: D5.1(anode) R21.2
NetD6_1: D6.1(anode) R2.2
NetD7_1: D7.1(anode) R6.2
NetD8_1: D8.1(anode) R4.2
NetD9_1: D9.1(anode) R13.2
NetD10_1: D10.1(anode) R14.2
NetD11_1: D11.1(anode) R15.2

### Buses and harness runs
bus LED[11..0] = port LED[11..0]

### Notes on the sheet
- nRF GPIO Resistance 20Ohm-60Ohm
- 1 mA Resistor Values
  @ Vbat = 2.8V
  Vf        |       R
  1.9V           900 Ohm
  2.0V           800 Ohm
  2.05V          750 Ohm
  2.20V          600 Ohm

### Library data of the parts
D0-D11 = 03-07205-000: Light Emitting Diode; Manufacturer 1: Osram; Manufacturer Part Number 1: LR Q396-P1Q2-1; Forward Voltage: 2V; Package / Case: 0603(1608); RoHS: Y; Item Number: 03-07205-000; Lifecycle: Preliminary; Link to Arena Files: https://app.bom.com/a/7P8HNI1I1KK6KAA1?v=files.associations; Supplier 1: Avnet; Supplier Part Number 1: LR Q396-P1Q2-1
R2 R4 R6 R13-R21 = 03-03249-000: Manufacturer 1: Panasonic Electronic Components; Manufacturer Part Number 1: ERJ-1GEJ271C; Case EIA: 201; Case Metric: 603; Tolerance: +/-5%; Legacy Item Number: R02059; Power Rating: 0.05W 1/20W; RoHS: Y; Item Number: 03-03249-000; Lifecycle: Preliminary; Link to Arena Files: https://app.bom.com/a/I0JSYTCTCVVIWRAT?v=files.associations; Supplier 1: Digi-key; Supplier Part Number 1: P270AGCT-ND; Manufacturer 2: Yageo; Manufacturer Part Number 2: RC0201JR-07270RL; Supplier 2: Digi-key; Supplier Part Number 2: 311-270NCT-ND

## Sheet P3_POWER.SchDoc: 06-00019-000 Venus
size A
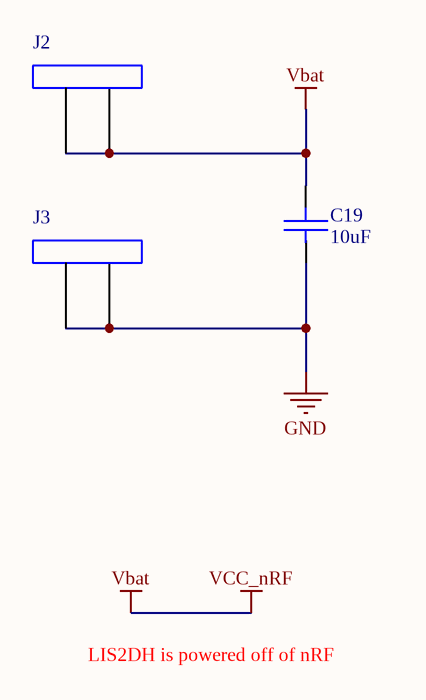
[diagram p5: P3_POWER.SchDoc]

### Parts
C19  value 10uF  [CAPC0603(1608)_N]  (hidden comment: CAP CER 10UF 6.3V 20% X5R 0603)
J2  Battery Contact Positive Low Profile  [BATT_POS_SPUTNIK]  (value not drawn)
J3  Coin Cell Battery Negative Contact  [BATT_NEG]  (value not drawn)

### Nets
GND: C19.1 J3.1 J3.2
Vbat: C19.2 J2.1 J2.2  [also labelled VCC_nRF]

### Notes on the sheet
- LIS2DH is powered off of nRF
- Title
- Size:
- Date:
- A
- Number:
- Time:
- Revision:
- Sheet
- of
- File:

### Library data of the parts
C19 = 03-01465-000: as C18 on sheet P5_ACCEL; Temperature Coefficient: X5R; RoHS: Y; Voltage Rating: 6.3V; Manufacturer 2: Samsung Electro-Mechanics America Inc; Item Number: 03-01465-000; Item Name: CAP CER 10UF 6.3V 20% X5R 0603; Lifecycle: Design; Manufacturer Item 2: 06036D106MAT2A; Link to Arena Files: https://app.bom.com/a/0I1AGBUBUDD0EBBR?v=files.associations; Manufacturer 3: AVX Corporation; Manufacturer 4: Kemet; Manufacturer Part Number 2: CL10A106MQ8NNNC; Manufacturer Part Number 3: 06036D106MAT2A; Manufacturer Part Number 4: C0603C106M9PACTU; Revision: 1; Supplier 1: Avnet; Supplier 2: Avnet; Supplier 3: Digi-key; Supplier 4: Digi-key; Supplier Part Number 1: NMC0603X5R106M6.3TRP4KF; Supplier Part Number 2: CL10A106MQ8NNNC; Supplier Part Number 3: 478-5318-1-ND; Supplier Part Number 4: 399-5504-1-ND
J2 = 03-07197-000: Legacy Item Number: J01009; Item Number: 03-07197-000; Item Name: Battery Contact Positive Low Profile; Lifecycle: Design; Link to Arena Files: https://app.bom.com/a/0I1AGBUBUDD0109B?v=files.associations; Revision: 1
J3 = 03-07148-000: Legacy Item Number: J01003; Item Number: 03-07148-000; Item Name: Coin Cell Battery Negative Contact; RoHS: Y; Lifecycle: Other; Link to Arena Files: https://app.bom.com/a/7P8HNI1I1KK7LDUI?v=files.associations; Revision: PR1

## Nets that join several sheets
GND: P2_SoC (26 pins), P5_ACCEL (9 pins), P7_DEBUG_CONN (J1.1), P3_POWER (C19.1 J3.1 J3.2)
Vbat: P2_SoC (5 pins), P7_DEBUG_CONN (J1.2), P4_LEDS (12 pins), P3_POWER (C19.2 J2.1 J2.2)
ACCEL_INT1: P2_SoC (U1.4), P5_ACCEL (TP4.1 U7.6)
ACCEL_INT2: P2_SoC (U1.5), P5_ACCEL (TP5.1 U7.5)
ACCEL_SPI_CLK: P2_SoC (U1.9), P5_ACCEL (TP8.1 U7.1)
ACCEL_SPI_CS: P2_SoC (U1.6), P5_ACCEL (TP11.1 U7.4)
ACCEL_SPI_MISO: P2_SoC (U1.7), P5_ACCEL (TP10.1 U7.3)
ACCEL_SPI_MOSI: P2_SoC (U1.8), P5_ACCEL (TP9.1 U7.2)
ACCEL_VDD: P2_SoC (TP3.1 U1.14), P5_ACCEL (5 pins)
LED0: P2_SoC (U1.27), P4_LEDS (D0.2)
LED1: P2_SoC (U1.26), P4_LEDS (D1.2)
LED2: P2_SoC (U1.18), P4_LEDS (D2.2)
LED3: P2_SoC (U1.16), P4_LEDS (D3.2)
LED4: P2_SoC (U1.15), P4_LEDS (D4.2)
LED5: P2_SoC (U1.3), P4_LEDS (D5.2)
LED6: P2_SoC (U1.47), P4_LEDS (D6.2)
LED7: P2_SoC (U1.48), P4_LEDS (D7.2)
LED8: P2_SoC (U1.41), P4_LEDS (D8.2)
LED9: P2_SoC (U1.40), P4_LEDS (D9.2)
LED10: P2_SoC (U1.44), P4_LEDS (D10.2)
LED11: P2_SoC (U1.42), P4_LEDS (D11.2)
LP_GPIO: P2_SoC (U1.28), P7_DEBUG_CONN (J1.9)
LP_SW: P2_SoC (C20.2 R7.1 TP1.1 U1.25), P7_DEBUG_CONN (J1.10)
nRF_SWCLK: P2_SoC (R1.1 U1.24), P7_DEBUG_CONN (J1.5)
nRF_SWDIO: P2_SoC (U1.23), P7_DEBUG_CONN (J1.6)
nRF_UART_CTS: P2_SoC (U1.21), P7_DEBUG_CONN (J1.4)
nRF_UART_RTS: P2_SoC (U1.22), P7_DEBUG_CONN (J1.7)
nRF_UART_RX: P2_SoC (U1.20), P7_DEBUG_CONN (J1.8)
nRF_UART_TX: P2_SoC (U1.19), P7_DEBUG_CONN (J1.3)

## Assembly variants
0000 (Standard): not fitted ANT1 C6 C15 J1 J1 R1 TP1 TP1 TP2 TP3 TP4 TP5 TP6 TP7 TP8 TP9 TP10 TP11